# Altium schematic sheet 6 cell amplifier.SchDoc
size A4; DocumentNumber: 6; SheetNumber: 8; SheetTotal: 9
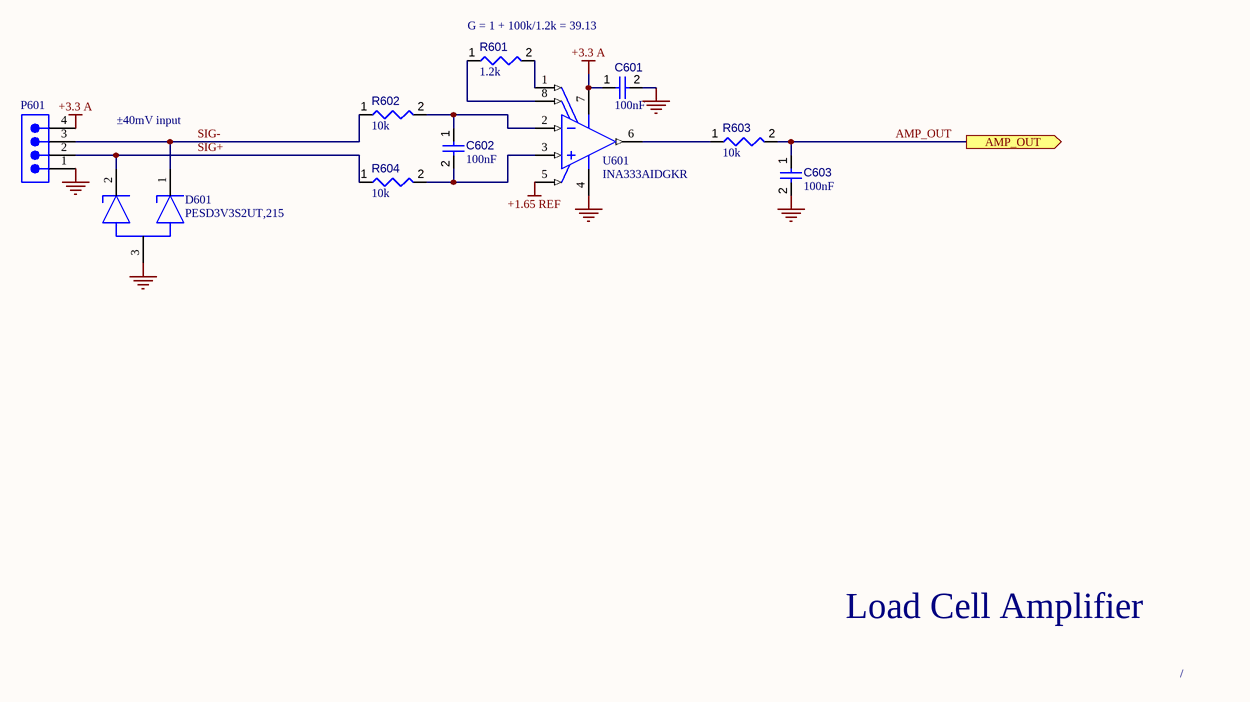
[diagram p0: 6 cell amplifier.SchDoc]

## Parts
C601  value 100nF  [CAPC0402(1005)60_L]  (hidden comment: Capacitor 100nF +/-20% 25V 0402)
C602  value 100nF  [CAPC0402(1005)60_L]  (hidden comment: Capacitor 100nF +/-20% 25V 0402)
C603  value 100nF  [CAPC0402(1005)60_L]  (hidden comment: Capacitor 100nF +/-20% 25V 0402)
D601  PESD3V3S2UT,215  [FP-SOT23-IPC_A]
P601  61300411121  [61300411121]  (value not drawn)
R601  value 1.2k  [RESC0402(1005)_L]  (hidden comment: Resistor 1K2 +/-1 % 0402 63 mW)
R602  value 10k  [RESC0402(1005)_L]  (hidden comment: Resistor 10K  +/-1 % 0402 63 mW)
R603  value 10k  [RESC0402(1005)_L]  (hidden comment: Resistor 10K  +/-1 % 0402 63 mW)
R604  value 10k  [RESC0402(1005)_L]  (hidden comment: Resistor 10K  +/-1 % 0402 63 mW)
U601  INA333AIDGKR  [DGK0008A_L]

## Ports
AMP_OUT (out)

## Nets
+1.65 REF: U601.5(REF)
+3.3 A: C601.1 P601.4 U601.7(V+)
GND: C601.2 C603.2 D601.3 P601.1 U601.4(V-)
AMP_OUT: C603.1 R603.2 ; port AMP_OUT
SIG+: D601.2 P601.2 R604.1
SIG-: D601.1 P601.3 R602.1
NetC602_1: C602.1 R602.2 U601.2(VIN-)
NetC602_2: C602.2 R604.2 U601.3(VIN+)
NetR601_1: R601.1 U601.8(RG)
NetR601_2: R601.2 U601.1(RG)
NetR603_1: R603.1 U601.6(VOUT)

## Notes on the sheet
- (near R601) G = 1 + 100k/1.2k = 39.13
- ±40mV input
- Load Cell Amplifier
- /

## Library data of the parts
C601-C603 = CMP-001-00065-4: Chip Capacitor, 100nF +/-20%, 25V, 0402, Thickness 0.6 mm; Tolerance: 10%; Max Operating Temperature: 85°C; Min Operating Temperature: -55°C; Pins: 2; Voltage Rating: 25V; Mounting Technology: SMT; Case/Package: 0402
D601 = CMP-14432-000008-1: TVS DIODE 3.3VWM 20VC TO236AB; RoHS Compliant: Yes
P601 = CMP-1502-01064-3: NexarPartId: 32855522; Operating Supply Voltage: 250V; Pitch: 2.54mm; Contact Resistance: 20mΩ; Number of Positions: 4; Current Rating: 3A; Connector Type: Male Pin; Gender: Male; Contact Plating: Gold; Height: 8.89mm; Lead Pitch: 2.54mm; Lead Free: Lead Free; Contact Mating Length: 5.9944mm; Number of Rows: 1; Termination: Solder; Packaging: Bulk; REACH SVHC: Unknown; Min Operating Temperature: -40°C; RoHS: Compliant; Number of Contacts: 4; Voltage Rating: 250V; Color: Black; Max Operating Temperature: 105°C; Contact Material: Copper; Mount: Through Hole; Orientation: Vertical; Number of Pins: 4
R601 = CMP-009-00157-3: Chip Resistor, 1.2 kOhms, +/-1 %, 63 mW, -55 to 155 degC, 0402; Tolerance: 1%; Power: 63mW; Case/Package: 0402; Pins: 2; Min Operating Temperature: -55°C; Max Operating Temperature: 155°C
R602-R604 = CMP-009-00149-3: Chip Resistor, 10 kOhms, +/-1 %, 63 mW, -55 to 125 degC, 0402; Power: 63mW; Tolerance: 1%; Min Operating Temperature: -55°C; Case/Package: 0402; Max Operating Temperature: 155°C; Pins: 2
U601 = CMP-0944-00088-2: Low Power, Precision Instrumentation Amplifier, -40 to 125 degC, 8-pin SOP (DGK8), Green (RoHS & no Sb/Br); Manufacturer: Texas Instruments; Input Offset Drift (+/-)(Max)(uV/Degrees Celsius): 0.1; Vs(Max)(V): 5.5; Input Bias Current (+/-)(Max)(nA): 0.2; Output Offset (+/-)(Max)(uV): 75/G; CMRR(Min)(dB): 100; Noise at 1kHz(Typ)(nV/rt(Hz)): 50; Output Offset Drift (+/-)(Max)(uV/Degrees Celsius): 0.5/G; Vs(Min)(V): 1.8; Quiescent Current (+/-)(Typ)(mA): 0.05; Gain(V/V): 1 to 1000; SubFamily: Single Supply; Number of Channels: 1; Input Offset (+/-)(Max)(uV): 25; Code_JEDEC: MO-187; Eco-Plan: Green (RoHS & no Sb/Br); ComponentLink2URL: http://www.ti.com/general/docs/lit/getliterature.tsp?genericPartNumber=INA333&fileType=pdf; Mounting Technology: Surface Mount; PartNumber: INA333AIDGKR; ComponentLink3URL: http://www.ti.com/litv/pdf/mpds028d; ComponentLink1URL: http://www.ti.com/; DatasheetVersion: SBOS445B; ComponentLink2Description: Datasheet; PackageVersion: 4073329/E, 05/2006; PackageReference: DGK0008A; ComponentLink3Description: Package Specification; PackageDescription: 8-Pin Thin Small Outline, Body 3 x 3 mm, Pitch 0.65 mm; ComponentLink1Description: Manufacturer URL